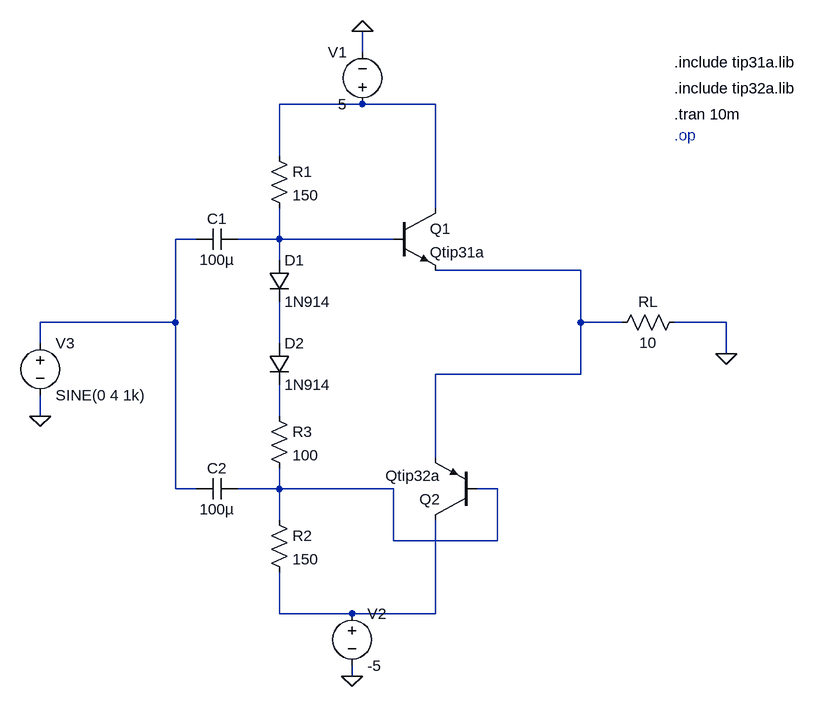
[diagram p0: schematic poweramp copy.asc]
poweramp copy.asc, the LTspice schematic file:
Version 4
SHEET 1 1200 912
WIRE 528 -64 528 -96
WIRE 528 16 400 16
WIRE 640 16 528 16
WIRE 400 96 400 16
WIRE 640 176 640 16
WIRE 272 224 240 224
WIRE 400 224 400 176
WIRE 400 224 336 224
WIRE 576 224 400 224
WIRE 400 256 400 224
WIRE 864 272 640 272
WIRE 240 352 240 224
WIRE 240 352 32 352
WIRE 864 352 864 272
WIRE 928 352 864 352
WIRE 1088 352 1008 352
WIRE 32 384 32 352
WIRE 400 384 400 320
WIRE 1088 400 1088 352
WIRE 864 432 864 352
WIRE 864 432 640 432
WIRE 32 496 32 464
WIRE 400 496 400 448
WIRE 640 560 640 432
WIRE 240 608 240 352
WIRE 272 608 240 608
WIRE 400 608 400 576
WIRE 400 608 336 608
WIRE 576 608 400 608
WIRE 736 608 704 608
WIRE 400 656 400 608
WIRE 576 688 576 608
WIRE 736 688 736 608
WIRE 736 688 576 688
WIRE 400 800 400 736
WIRE 512 800 400 800
WIRE 640 800 640 656
WIRE 640 800 512 800
WIRE 512 896 512 880
FLAG 512 896 0
FLAG 528 -96 0
FLAG 1088 400 0
FLAG 32 496 0
SYMBOL Cap 336 208 R90
WINDOW 0 0 32 VBottom 2
WINDOW 3 32 32 VTop 2
SYMATTR InstName C1
SYMATTR Value 100µ
SYMBOL Cap 336 592 R90
WINDOW 0 0 32 VBottom 2
WINDOW 3 32 32 VTop 2
SYMATTR InstName C2
SYMATTR Value 100µ
SYMBOL Res 384 80 R0
SYMATTR InstName R1
SYMATTR Value 150
SYMBOL Res 384 640 R0
SYMATTR InstName R2
SYMATTR Value 150
SYMBOL npn 576 176 R0
SYMATTR InstName Q1
SYMATTR Value Qtip31a
SYMBOL pnp 704 656 R180
SYMATTR InstName Q2
SYMATTR Value Qtip32a
SYMBOL Voltage 528 32 R180
WINDOW 0 24 96 Left 2
WINDOW 3 24 16 Left 2
SYMATTR InstName V1
SYMATTR Value 5
SYMBOL Voltage 512 784 R0
SYMATTR InstName V2
SYMATTR Value -5
SYMBOL Res 1024 336 R90
WINDOW 0 0 56 VBottom 2
WINDOW 3 32 56 VTop 2
SYMATTR InstName RL
SYMATTR Value 10
SYMBOL Voltage 32 368 R0
SYMATTR InstName V3
SYMATTR Value SINE(0 4 1k)
SYMBOL diode 384 256 R0
SYMATTR InstName D1
SYMATTR Value 1N914
SYMBOL diode 384 384 R0
SYMATTR InstName D2
SYMATTR Value 1N914
SYMBOL Res 384 480 R0
SYMATTR InstName R3
SYMATTR Value 100
TEXT 1008 -48 Left 2 !.include tip31a.lib
TEXT 1008 -8 Left 2 !.include tip32a.lib
TEXT 1008 32 Left 2 !.tran 10m
TEXT 1008 64 Left 2 ;.op

The netlist it stands for:
* poweramp copy.asc
C1 N003 N002 100µ
C2 N007 N002 100µ
R1 N001 N003 150
R2 N007 N008 150
Q1 N001 N003 N004 0 Qtip31a
Q2 N008 N007 N004 0 Qtip32a
V1 N001 0 5
V2 N008 0 -5
RL 0 N004 10
V3 N002 0 SINE(0 4 1k)
D1 N003 N005 1N914
D2 N005 N006 1N914
R3 N006 N007 100
.model D D
.lib standard.dio
.model NPN NPN
.model PNP PNP
.lib standard.bjt
.include tip31a.lib
.include tip32a.lib
.tran 10m
* .op
.backanno
.end